# EAGLE design arduino_lcd_shield (EAGLE 9.6.2)
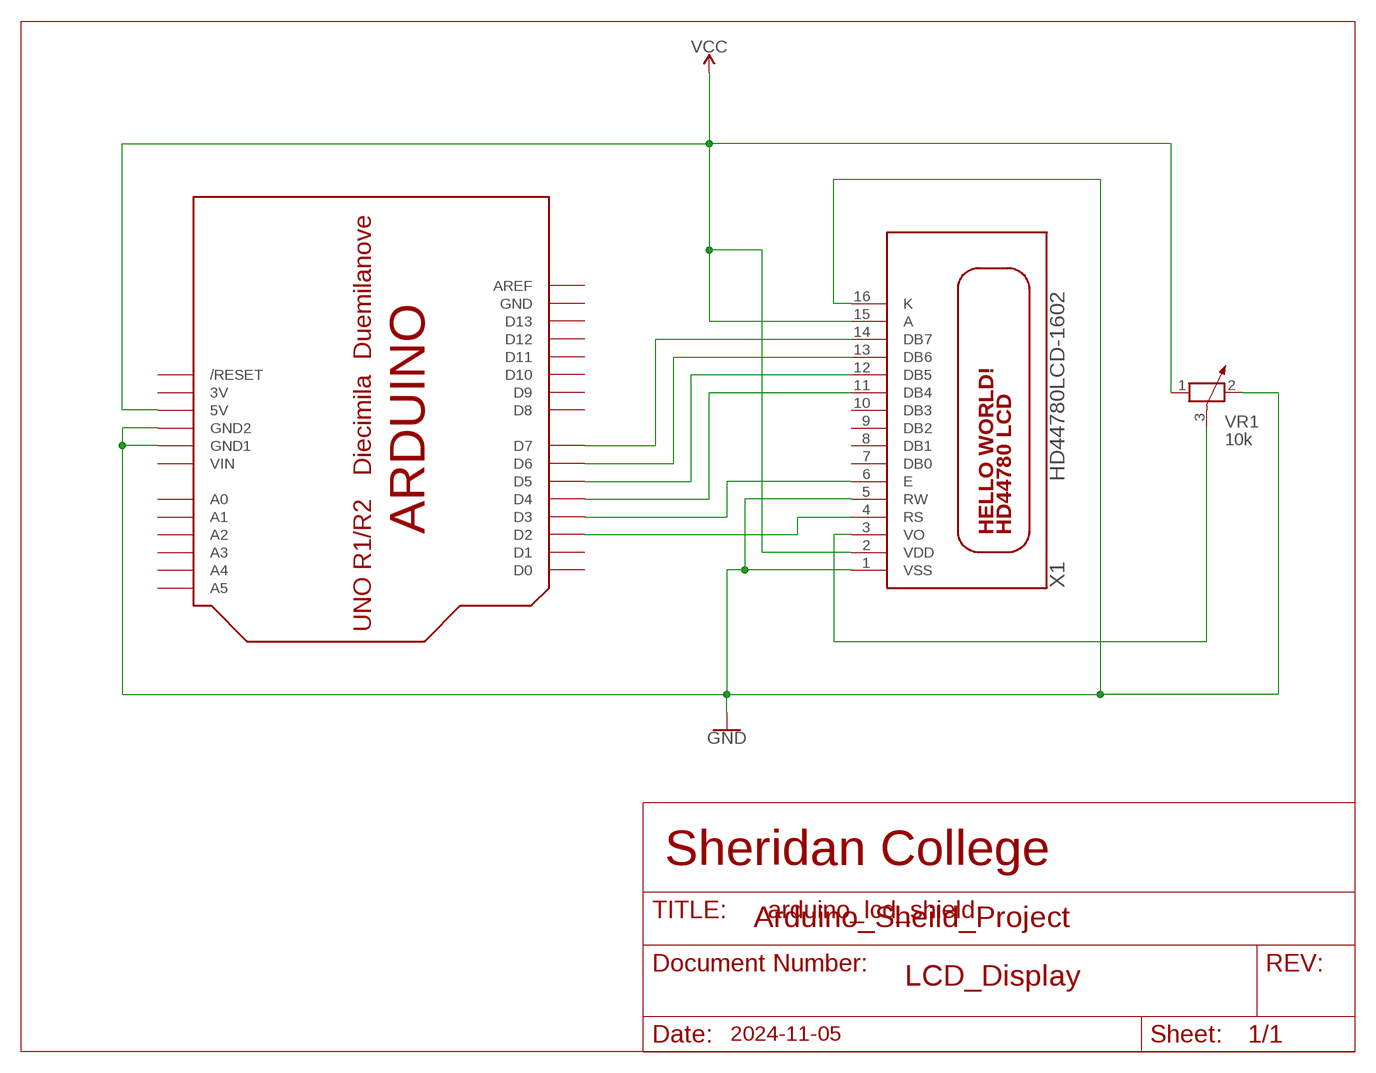
[diagram p0: schematic, sheet 1]

## Parts
U$1  ARDUINOUNO  [ARDUINO]
VR1  10k  POTENTIOMETER_PT-10  [PT-10]
X1  HD44780LCD-1602  [LCD1602]

## Nets
N$1: U$1.D7 X1.14(DB7)
N$2: U$1.D6 X1.13(DB6)
N$3: U$1.D5 X1.12(DB5)
N$4: U$1.D4 X1.11(DB4)
N$5: U$1.D3 X1.6(E)
N$6: VR1.3 X1.3(VO)
N$8: U$1.D2 X1.4(RS)
VDD: U$1.5V VR1.1 X1.2(VDD) X1.15(A) ; supply symbol labelled VCC
VSS: U$1.GND1 U$1.GND2 VR1.2 X1.1(VSS) X1.5(RW) X1.16(K) ; supply symbol labelled GND
Unconnected: U$1.A0 U$1.A1 U$1.A2 U$1.A3 U$1.A4 U$1.A5 U$1.AREF U$1.D0 U$1.D1 U$1.D8 U$1.D9 U$1.D10 U$1.D11 U$1.D12 U$1.D13 U$1.RESET(/RESET) X1.7(DB0) X1.8(DB1) X1.9(DB2) X1.10(DB3)

## Notes on the sheet
- Sheridan College
- Arduino_Sheild_Project
- LCD_Display
- 2024-11-05

## Power pins joined to a net without a drawn wire
3V: U$1.3V
VIN: U$1.VIN
VSS: U$1.GND

## Library data of the parts
U$1 = adafruit:ARDUINO: Arduino Diecimila/Duemilanove Make a shield with ease, this package has all the named pins as well as the two mounting drill holes and an outline of the USB and DC power connector. The outline is on the DIMENSION layer, so if your board house uses it they will cut the outline to match. http://www.ladyada.net/library/pcb/eaglelibrary.html
VR1 = rcl:POTENTIOMETER_: Potentiometer; SPICEMODEL: POT; SPICEPREFIX: X
X1 = adafruit:HD44780LCD: HD44780 LCD Standard character type LCDs, available in sizes from 8x1 to 40x4!

## Board
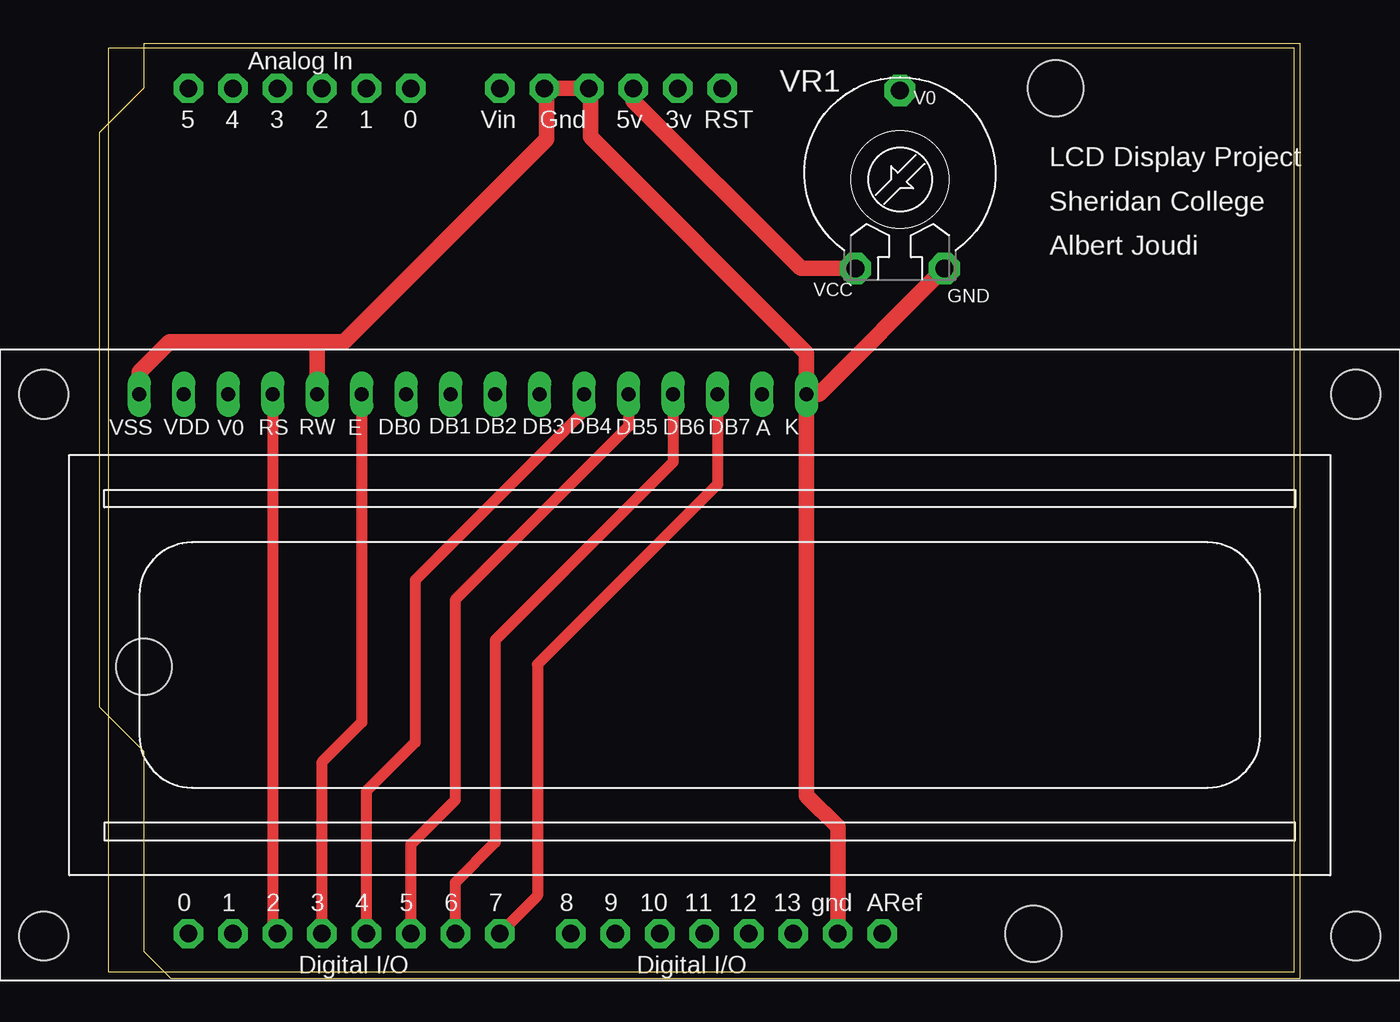
[diagram p1: board, top side]
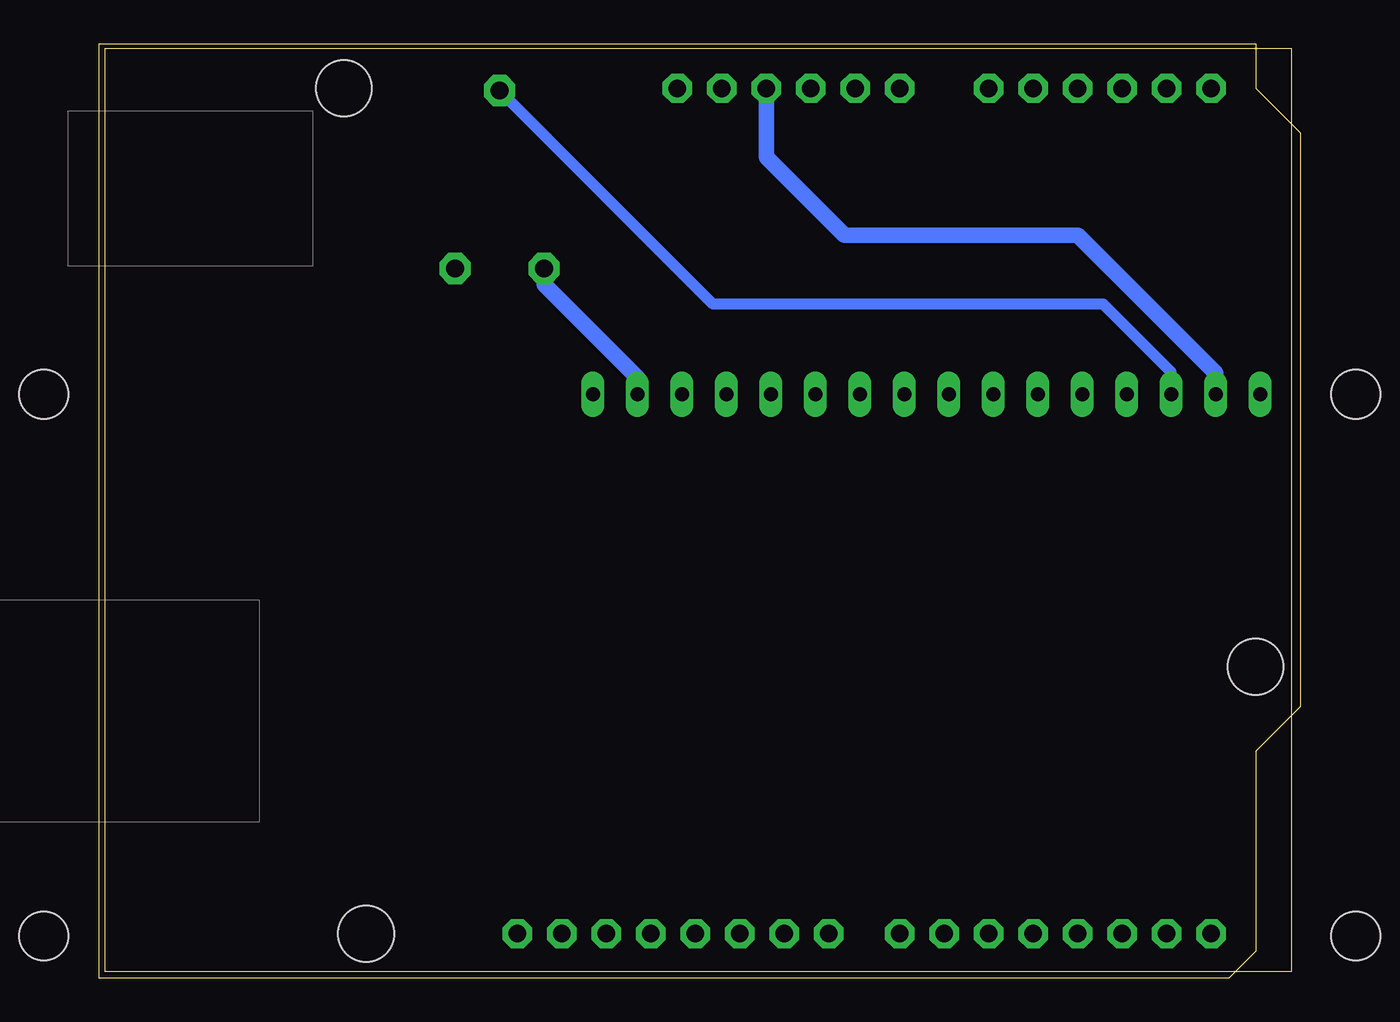
[diagram p2: board, bottom side, seen from below]

Size 67.74 x 52.7 mm. Coordinates in mm from the lower left corner, seen from the top.
Outline: 0,0 67.74,0 67.74,52.7 0,52.7 0,0
Copper layers (1*16): Top 0.035mm / dielectric 1.5mm / Bottom 0.035mm
Design rules "default *": minimum track width 25mil, minimum drill 0.35mm, track to track 25mil, track to pad 25mil, pad to pad 25mil, via to via 25mil, smd to smd 6mil, copper to edge 40mil, drill to drill 25mil, minimum pad ring 10mil, minimum via ring 8mil, stop-mask expansion 4mil, vias tented up to drill 0mil, thermal gap 10mil

### Footprints (pad centres in the part's own frame; a part is rotated, then mirrored left to right if it is on the bottom)
ARDUINO = drill 1 pad 1.676 octagon: 3V 35.56,2.54; 5V 38.1,2.54; A0 50.8,2.54; A1 53.34,2.54; A2 55.88,2.54; A3 58.42,2.54; A4 60.96,2.54; A5 63.5,2.54; AREF 23.876,50.8; D0 63.5,50.8; D1 60.96,50.8; D2 58.42,50.8; D3 55.88,50.8; D4 53.34,50.8; D5 50.8,50.8; D6 48.26,50.8; D7 45.72,50.8; D8 41.656,50.8; D9 39.116,50.8; D10 36.576,50.8; D11 34.036,50.8; D12 31.496,50.8; D13 28.956,50.8; GND 26.416,50.8; GND1 43.18,2.54; GND2 40.64,2.54; RESET 33.02,2.54; VIN 45.72,2.54 | hole 3.2: 15.24,50.8; 66.04,35.56; 13.97,2.54
PT-10 = drill 1.016 pad 1.778 octagon: 1 -2.54,-5.08; 2 2.54,-5.08; 3 0,5.08
LCD1602 = drill 0.8 long: 1 8,33.46; 2 10.54,33.46; 3 13.08,33.46; 4 15.62,33.46; 5 18.16,33.46; 6 20.7,33.46; 7 23.24,33.46; 8 25.78,33.46; 9 28.32,33.46; 10 30.86,33.46; 11 33.4,33.46; 12 35.94,33.46; 13 38.48,33.46; 14 41.02,33.46; 15 43.56,33.46; 16 46.1,33.46 | hole 2.8: 2.54,2.54; 2.54,33.46; 77.46,33.46; 77.46,2.54

### Placement (x,y rotation side)
U$1  68.07,52.96 180 top
VR1  45.21,45.21 0 top
X1  -6.22,-0.51 0 top

### Tracks (layer width: path | path; a pad name or v marks a point on that pad's centre or on a via)
N$1
  Top 0.635: X1.14 34.8,27.81 24.51,17.53 24.51,4.32 U$1.D7
N$2
  Top 0.635: X1.13 32.26,29.08 22.1,18.92 22.1,7.37 19.81,5.08 U$1.D6
N$3
  Top 0.635: X1.12 29.72,31.11 19.81,21.21 19.81,9.78 17.27,7.24 U$1.D5
N$4
  Top 0.635: X1.11 27.18,31.99 17.53,22.34 17.53,13.08 14.73,10.29 U$1.D4
N$5
  Top 0.635: X1.6 14.48,14.22 12.19,11.94 U$1.D3
N$6
  Bottom 0.635: X1.3 6.86,34.22 10.73,38.1 33.02,38.1 VR1.3
N$8
  Top 0.635: X1.4 9.4,2.41 U$1.D2
VDD
  Top 0.889: U$1.5V 29.97,49.71 39.55,40.13 VR1.1
  Bottom 0.889: X1.2 4.32,34.16 12.19,42.04 25.53,42.04 29.97,46.48 U$1.5V | VR1.1 42.67,39.24 37.34,33.91 X1.15
VSS
  Top 0.635: 25.02,50.29 U$1.GND1 | U$1.GND2 27.53,50.32
  Top 0.889: VR1.2 40.57,32.95 X1.16 | X1.16 39.88,10.03 41.66,8.25 U$1.GND | X1.1 1.78,34.22 3.5,35.94 11.99,35.94 | 25.02,50.29 25.02,47.5 13.46,35.94 11.99,35.94 | U$1.GND1 U$1.GND2 | 27.53,50.32 27.53,47.65 39.88,35.31 X1.16 | X1.5 11.94,35.89 11.99,35.94

### Text on the board
tPlace: V0 | LCD Display Project | Sheridan College | Albert Joudi | VCC | GND | VSS | VDD | V0 | RS | RW | E | DB0 | DB1 | DB2 | DB3 | DB4 | DB5 | DB6 | DB7 | A | K